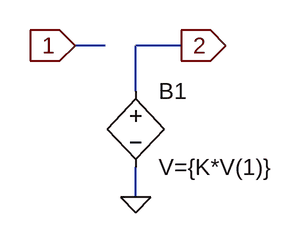
[diagram p0: schematic Draft6.asc]
Draft6.asc, the LTspice schematic file:
Version 4
SHEET 1 880 680
WIRE 128 144 96 144
WIRE 208 144 160 144
WIRE 160 192 160 144
WIRE 160 304 160 272
FLAG 96 144 1
IOPIN 96 144 In
FLAG 208 144 2
IOPIN 208 144 Out
FLAG 160 304 0
SYMBOL bv 160 176 R0
SYMATTR InstName B1
SYMATTR Value V={K*V(1)}

The netlist it stands for:
* Draft6.asc
B1 2 0 V={K*V(1)}
.backanno
.end